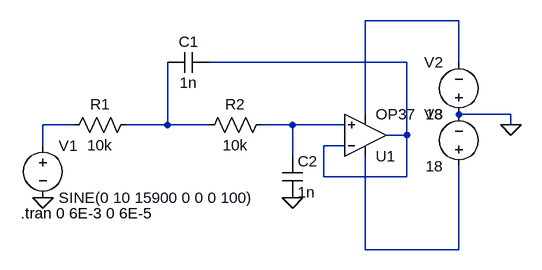
[diagram p0: schematic sallenKeyLTSPICE.asc]
sallenKeyLTSPICE.asc, the LTspice schematic file:
Version 4
SHEET 1 880 680
WIRE 624 -48 480 -48
WIRE 544 16 240 16
WIRE 624 16 624 -48
WIRE 480 96 480 -48
WIRE 704 96 624 96
WIRE 32 112 -16 112
WIRE 176 112 176 16
WIRE 176 112 112 112
WIRE 240 112 176 112
WIRE 368 112 320 112
WIRE 448 112 368 112
WIRE 704 112 704 96
WIRE 544 128 544 16
WIRE 544 128 512 128
WIRE -16 144 -16 112
WIRE 448 144 416 144
WIRE 368 160 368 112
WIRE 416 192 416 144
WIRE 544 192 544 128
WIRE 544 192 416 192
WIRE 480 304 480 160
WIRE 624 304 624 176
WIRE 624 304 480 304
FLAG 368 224 0
FLAG -16 224 0
FLAG 704 112 0
SYMBOL res 128 96 R90
WINDOW 0 0 56 VBottom 2
WINDOW 3 32 56 VTop 2
SYMATTR InstName R1
SYMATTR Value 10k
SYMBOL cap 240 0 R90
WINDOW 0 0 32 VBottom 2
WINDOW 3 32 32 VTop 2
SYMATTR InstName C1
SYMATTR Value 1n
SYMBOL res 336 96 R90
WINDOW 0 0 56 VBottom 2
WINDOW 3 32 56 VTop 2
SYMATTR InstName R2
SYMATTR Value 10k
SYMBOL cap 352 160 R0
SYMATTR InstName C2
SYMATTR Value 1n
SYMBOL voltage -16 128 R0
WINDOW 123 0 0 Left 2
WINDOW 39 0 0 Left 2
SYMATTR InstName V1
SYMATTR Value SINE(0 10 15900 0 0 0 100)
SYMBOL Opamps\\OP37 480 192 M180
SYMATTR InstName U1
SYMBOL voltage 624 112 R180
WINDOW 0 24 96 Left 2
WINDOW 3 24 16 Left 2
WINDOW 123 0 0 Left 2
WINDOW 39 0 0 Left 2
SYMATTR InstName V2
SYMATTR Value 18
SYMBOL voltage 624 192 R180
WINDOW 0 24 96 Left 2
WINDOW 3 24 16 Left 2
WINDOW 123 0 0 Left 2
WINDOW 39 0 0 Left 2
SYMATTR InstName V3
SYMATTR Value 18
TEXT -50 248 Left 2 !.tran 0 6E-3 0 6E-5

The netlist it stands for:
* sallenKeyLTSPICE.asc
R1 N004 N003 10k
C1 N002 N004 1n
R2 N005 N004 10k
C2 N005 0 1n
V1 N003 0 SINE(0 10 15900 0 0 0 100)
XU1 N005 N002 N006 N001 N002 LT1037  ; OP37, pins In+ In- V+ V- OUT
V2 0 N001 18
V3 N006 0 18
.tran 0 6E-3 0 6E-5
.lib LTC.lib
.backanno
.end